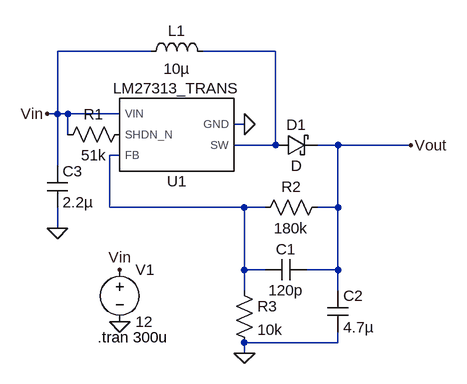
[diagram p0: schematic Przetwornica24V.asc]
Przetwornica24V.asc, the LTspice schematic file:
Version 4
SHEET 1 880 680
WIRE 176 -512 32 -512
WIRE 368 -512 256 -512
WIRE 32 -416 32 -512
WIRE 32 -416 16 -416
WIRE 48 -416 32 -416
WIRE 128 -416 48 -416
WIRE 320 -400 304 -400
WIRE 48 -384 48 -416
WIRE 368 -368 368 -512
WIRE 368 -368 304 -368
WIRE 464 -368 432 -368
WIRE 576 -368 464 -368
WIRE 128 -352 112 -352
WIRE 32 -336 32 -416
WIRE 112 -272 112 -352
WIRE 320 -272 112 -272
WIRE 352 -272 320 -272
WIRE 464 -272 464 -368
WIRE 464 -272 432 -272
WIRE 32 -240 32 -272
WIRE 320 -176 320 -272
WIRE 352 -176 320 -176
WIRE 464 -176 464 -272
WIRE 464 -176 416 -176
WIRE 320 -144 320 -176
WIRE 464 -144 464 -176
WIRE 464 -64 464 -80
WIRE 464 -64 320 -64
WIRE 320 -48 320 -64
FLAG 16 -416 Vin
FLAG 320 -400 0
FLAG 32 -240 0
FLAG 320 -48 0
FLAG 576 -368 Vout
FLAG 128 -96 0
FLAG 128 -176 Vin
SYMBOL AutoGenerated\\LM27313_TRANS 224 -384 R180
SYMATTR InstName U1
SYMBOL res 144 -400 R90
WINDOW 0 0 56 VBottom 2
WINDOW 3 32 56 VTop 2
SYMATTR InstName R1
SYMATTR Value 51k
SYMBOL schottky 368 -352 R270
WINDOW 0 32 32 VTop 2
WINDOW 3 0 32 VBottom 2
SYMATTR InstName D1
SYMBOL res 448 -288 R90
WINDOW 0 0 56 VBottom 2
WINDOW 3 32 56 VTop 2
SYMATTR InstName R2
SYMATTR Value 180k
SYMBOL res 304 -160 R0
SYMATTR InstName R3
SYMATTR Value 10k
SYMBOL cap 416 -192 R90
WINDOW 0 0 32 VBottom 2
WINDOW 3 32 32 VTop 2
SYMATTR InstName C1
SYMATTR Value 120p
SYMBOL cap 448 -144 R0
SYMATTR InstName C2
SYMATTR Value 4.7µ
SYMBOL cap 16 -336 R0
SYMATTR InstName C3
SYMATTR Value 2.2µ
SYMBOL voltage 128 -192 R0
WINDOW 123 0 0 Left 0
WINDOW 39 0 0 Left 0
SYMATTR InstName V1
SYMATTR Value 12
SYMBOL ind 160 -496 R270
WINDOW 0 32 56 VTop 2
WINDOW 3 5 56 VBottom 2
SYMATTR InstName L1
SYMATTR Value 10µ
TEXT 94 -72 Left 2 !.tran 300u

The netlist it stands for:
* Przetwornica24V.asc
XU1 N001 0 N002 P001 Vin LM27313_TRANS  ; pins SW GND FB SHDN_N VIN
R1 P001 Vin 51k
D1 N001 Vout D
R2 Vout N002 180k
R3 N002 0 10k
C1 Vout N002 120p
C2 Vout 0 4.7µ
C3 Vin 0 2.2µ
V1 Vin 0 12
L1 Vin N001 10µ
.model D D
.lib standard.dio
.tran 300u
.lib LM27313_TRANS.LIB
.backanno
.end